# Altium schematic sheet Buck.SchDoc
size A3; SheetNumber: 1; SheetTotal: 1
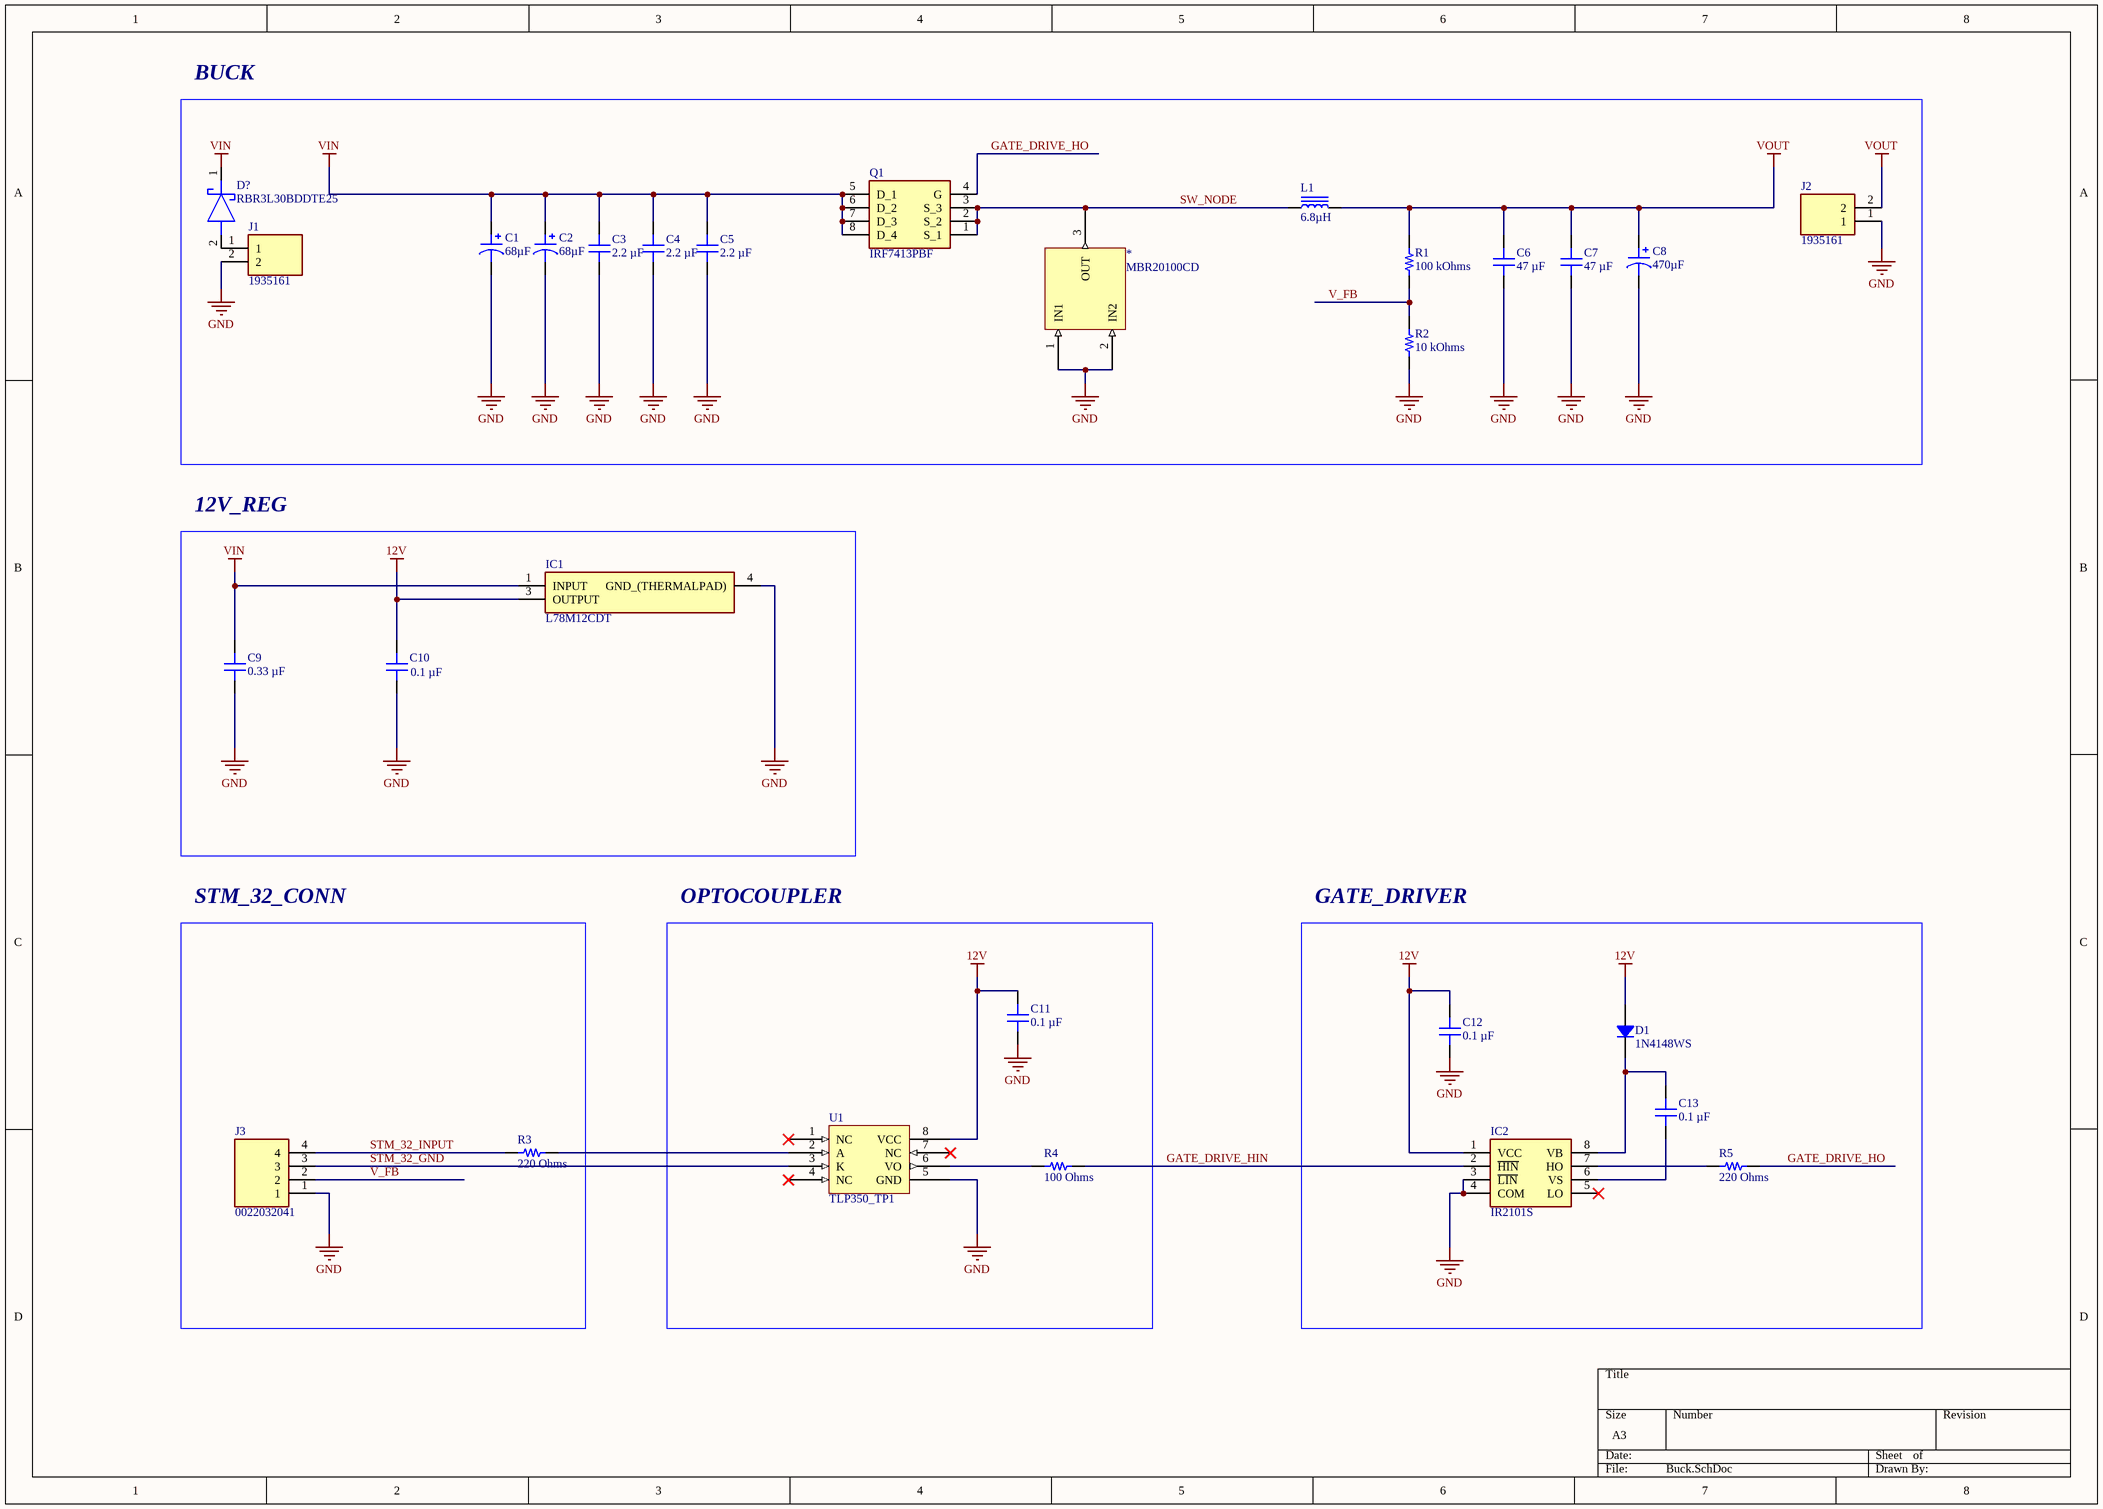
[diagram p0: Buck.SchDoc]

## Parts
*  MBR20100CD  [SC_TO-252AA]
C1  68µF  [CAP ALSMD 6.6MM H6.1MM]
C2  68µF  [CAP ALSMD 6.6MM H6.1MM]
C3  2.2 µF  [CAP 1210_3225 - 1MM]
C4  2.2 µF  [CAP 1210_3225 - 1MM]
C5  2.2 µF  [CAP 1210_3225 - 1MM]
C6  47 µF  [CAP 1210_3225 - 1MM]
C7  47 µF  [CAP 1210_3225 - 1MM]
C8  470µF  [CAP ALSMD 6.6MM H8.0MM]
C9  0.33 µF  [CAP 1210_3225 - 1MM]
C10  0.1 µF  [CAP 1210_3225 - 1MM]
C11  0.1 µF  [CAP 0805_2012]
C12  0.1 µF  [CAP 0805_2012]
C13  0.1 µF  [CAP 0805_2012]
D1  1N4148WS  [SOD323F]
D?  RBR3L30BDDTE25  [DIOM5026X220N]
IC1  L78M12CDT  [TO228P972X240-3N]
IC2  IR2101S  [SOIC127P600X175-8N]
J1  1935161  [1935161]
J2  1935161  [1935161]
J3  0022032041  [HDRV4W87P0X254_1X4_991X236X1155P]
L1  6.8µH  [BOURNS SRR1280]
Q1  IRF7413PBF  [SOIC127P600X175-8N]
R1  100 kOhms  [RES 0805_2012]
R2  10 kOhms  [RES 0805_2012]
R3  220 Ohms  [RES 0805_2012]
R4  100 Ohms  [RES 0805_2012]
R5  220 Ohms  [RES 0805_2012]
U1  TLP350_TP1  [SOP254P1000X425-8N]

## Blocks framed on the sheet
BUCK: * C1-C8 D? J1 J2 L1 Q1 R1 R2
12V_REG: C9 C10 IC1
STM_32_CONN: J3 R3
OPTOCOUPLER: C11 R4 U1
GATE_DRIVER: C12 C13 D1 IC2 R5

## Nets
12V: C10.2 C11.2 C12.2 D1.1 IC1.3(OUTPUT) IC2.1(VCC) U1.8(VCC)
GND: *.1(IN1) *.2(IN2) C1.2 C2.2 C3.1 C4.1 C5.1 C6.1 C7.1 C8.2 C9.1 C10.1 C11.1 C12.1 IC1.4(GND_(THERMALPAD)) IC2.3(~{LIN}) IC2.4(COM) J1.2 J2.1 J3.1 R2.1 U1.5(GND)
VIN: C1.1 C2.1 C3.2 C4.2 C5.2 C9.2 D?.1(K) IC1.1(INPUT) Q1.5(D_1) Q1.6(D_2) Q1.7(D_3) Q1.8(D_4)
VOUT: C6.2 C7.2 C8.1 J2.2 L1.2 R1.2
GATE_DRIVE_HIN: IC2.2(~{HIN}) R4.2
GATE_DRIVE_HO: Q1.4(G) R5.2
STM_32_GND: J3.3 U1.3(K)
STM_32_INPUT: J3.4 R3.1
SW_NODE: *.3(OUT) L1.1 Q1.1(S_1) Q1.2(S_2) Q1.3(S_3)
V_FB: J3.2 R1.1 R2.2
NetC13_1: C13.1 IC2.6(VS)
NetC13_2: C13.2 D1.2 IC2.8(VB)
NetD?_2: D?.2(A) J1.1
NetIC2_7: IC2.7(HO) R5.1
NetR3_2: R3.2 U1.2(A)
NetR4_1: R4.1 U1.6(VO)

Not connected (* = marked no-connect by the designer): IC2 5(LO)*; U1 1(NC)* 4(NC)* 7(NC)*

## Library data of the parts
C1 C2 = UWD1E680MCL1GS: CAP ALUM 68UF 20% 25V SMD; Manufacturer: Nichicon; Impedance: 440 mOhms; Lifetime @ Temp.: 2000 Hrs @ 105°C; Ripple Current @ High Frequency: 230mA @ 100kHz; Ripple Current @ Low Frequency: 115mA @ 120Hz; Surface Mount Land Size: 0.260" L x 0.260" W (6.60mm x 6.60mm); Part Number: UWD1E680MCL1GS; Applications: General Purpose; Capacitance: 68µF; ComponentLink1Description: Datasheet; ComponentLink1URL: http://nichicon-us.com/english/products/pdfs/e-uwd.pdf; ComponentLink2Description: DigiKey Link; ComponentLink2URL: http://digikey.com/product-detail/en/nichicon/UWD1E680MCL1GS/493-9673-1-ND/3963005; Device Package: Radial, Can - SMD; Height - Seated (Max): 0.228" (5.80mm); LastUpdated: 1/21/2020 2:33:32 AM; Lifecycle Status: Active; Minimum Order: 1; Mounting Type: Surface Mount; Operating Temperature: -55°C ~ 105°C; Package / Case: Radial, Can - SMD; Packaging: TapeAndReel; PartId: 8861; Part Status: Active; Price: 0.22; Series: UWD; Size / Dimension: 0.248" Dia (6.30mm); Supplier 1: DigiKey; Supplier Part Number 1: 493-9673-1-ND; Tolerance: ±20%; Value: 68µF; Voltage - Rated: 25V
C3-C5 = TMF325B7225KMHP: CAP CER 2.2UF 25V X7R 1210; manufacturer: Taiyo Yuden; Tolerance: ±10%; Part Number: TMF325B7225KMHP; Value: 2.2 µF; Applications: Automotive, SMPS Filtering; Capacitance: 2.2 µF; componentlink1description: Datasheet; componentlink1url: https://ds.yuden.co.jp/TYCOMPAS/ut/detail?pn=TMF325B7225KMHP&u=M; componentlink2description: DigiKey Link; componentlink2url: https://www.digikey.com/en/products/detail/taiyo-yuden/TMF325B7225KMHP/10379029; Device Package: 1210 (3225 Metric); lastupdated: 9/19/2022 01:23:29 PM; Lifecycle Status: Active; Minimum Order: 1; Mounting Type: Surface Mount, MLCC; Operating Temperature: -55°C ~ 125°C; Package / Case: 1210 (3225 Metric); packaging: TapeAndReel; partid: 23880; Part Status: Active; price: 0.17; Ratings: AEC-Q200; series: M; Size / Dimension: 0.126" L x 0.098" W (3.20mm x 2.50mm); Supplier 1: DigiKey; Supplier Part Number 1: 587-6463-1-ND; Temperature Coefficient: X7R; Thickness (Max): 0.106" (2.70mm); Voltage - Rated: 25V
C6 C7 = GRM32ED71A476KE15L: CAP CER 47UF 10V X7T 1210; Part Number: GRM32ED71A476KE15L; Value: 47 µF
C8 = EMZR100ARA471MF80G: CAP ALUM 470UF 20% 10V SMD; Manufacturer: United Chemi-Con; ESR (Equivalent Series Resistance): 160 mohm @ 100kHz; Lifetime @ Temp.: 2000 Hrs @ 105°C; Polarization: Polar; Ripple Current @ High Frequency: 600mA @ 100kHz; Ripple Current @ Low Frequency: 300mA @ 120Hz; Surface Mount Land Size: 0.260" L x 0.260" W (6.60mm x 6.60mm); Part Number: EMZR100ARA471MF80G; Applications: Automotive; Capacitance: 470µF; ComponentLink1Description: Datasheet; ComponentLink1URL: http://www.chemi-con.co.jp/cgi-bin/CAT_DB/SEARCH/cat_db_al.cgi?e=e&j=p&pdfname=mzr; ComponentLink2Description: DigiKey Link; ComponentLink2URL: http://digikey.com/product-detail/en/united-chemi-con/EMZR100ARA471MF80G/565-5133-1-ND/8637128; Device Package: Radial, Can - SMD; Height - Seated (Max): 0.315" (8.00mm); LastUpdated: 1/21/2020 4:06:45 AM; Lifecycle Status: Active; Minimum Order: 1; Mounting Type: Surface Mount; Operating Temperature: -55°C ~ 105°C; Package / Case: Radial, Can - SMD; Packaging: TapeAndReel; PartId: 8433; Part Status: Active; Price: 0.20; Ratings: AEC-Q200; Series: Alchip™- MZR; Size / Dimension: 0.248" Dia (6.30mm); Supplier 1: DigiKey; Supplier Part Number 1: 565-5133-1-ND; Tolerance: ±20%; Value: 470µF; Voltage - Rated: 10V
C9 = 885012209044: CAP CER 0.33UF 50V X7R 1210; manufacturer: Würth Elektronik; Tolerance: ±10%; Part Number: 885012209044; Value: 0.33 µF; Applications: General Purpose; Capacitance: 0.33 µF; componentlink1description: Datasheet; componentlink1url: https://katalog.we-online.de/pbs/datasheet/885012209044.pdf; componentlink2description: DigiKey Link; componentlink2url: https://www.digikey.com/en/products/detail/würth-elektronik/885012209044/5453596; Device Package: 1210 (3225 Metric); lastupdated: 9/19/2022 01:23:29 PM; Lifecycle Status: Active; Minimum Order: 1; Mounting Type: Surface Mount, MLCC; Operating Temperature: -55°C ~ 125°C; Package / Case: 1210 (3225 Metric); packaging: TapeAndReel; partid: 25056; Part Status: Active; price: 0.36; series: WCAP-CSGP; Size / Dimension: 0.126" L x 0.098" W (3.20mm x 2.50mm); Supplier 1: DigiKey; Supplier Part Number 1: 732-7741-1-ND; Temperature Coefficient: X7R; Thickness (Max): 0.053" (1.35mm); Voltage - Rated: 50V
C10 = UMF325B7104KNHT: CAP CER 0.1UF 50V X7R 1210; manufacturer: Taiyo Yuden; Tolerance: ±10%; Part Number: UMF325B7104KNHT; Value: 0.1 µF; Applications: Automotive, SMPS Filtering; Capacitance: 0.1 µF; componentlink1description: Datasheet; componentlink1url: https://ds.yuden.co.jp/TYCOMPAS/ut/detail?pn=UMF325B7104KNHT&u=M; componentlink2description: DigiKey Link; componentlink2url: https://www.digikey.com/en/products/detail/taiyo-yuden/UMF325B7104KNHT/10379043; Device Package: 1210 (3225 Metric); lastupdated: 9/19/2022 01:23:27 PM; Lifecycle Status: Active; Minimum Order: 1; Mounting Type: Surface Mount, MLCC; Operating Temperature: -55°C ~ 125°C; Package / Case: 1210 (3225 Metric); packaging: TapeAndReel; partid: 24590; Part Status: Active; price: 0.12; Ratings: AEC-Q200; series: M; Size / Dimension: 0.126" L x 0.098" W (3.20mm x 2.50mm); Supplier 1: DigiKey; Supplier Part Number 1: 587-6477-1-ND; Temperature Coefficient: X7R; Thickness (Max): 0.083" (2.10mm); Voltage - Rated: 50V
C11-C13 = CC0805MRX7R9BB104: CAP CER 0.1UF 50V X7R 0805; manufacturer: Yageo; Tolerance: ±20%; Part Number: CC0805MRX7R9BB104; Value: 0.1 µF; Applications: General Purpose; Capacitance: 0.1 µF; componentlink1description: Datasheet; componentlink1url: https://www.yageo.com/upload/media/product/productsearch/datasheet/mlcc/UPY-GPHC_X7R_6.3V-to-50V_18.pdf; componentlink2description: DigiKey Link; componentlink2url: https://www.digikey.com/en/products/detail/yageo/CC0805MRX7R9BB104/5884281; Device Package: 0805 (2012 Metric); lastupdated: 9/19/2022 01:04:26 PM; Lifecycle Status: Active; Minimum Order: 1; Mounting Type: Surface Mount, MLCC; Operating Temperature: -55°C ~ 125°C; Package / Case: 0805 (2012 Metric); packaging: TapeAndReel; partid: 2475; Part Status: Active; price: 0.02; series: CC; Size / Dimension: 0.079" L x 0.049" W (2.00mm x 1.25mm); Supplier 1: DigiKey; Supplier Part Number 1: 311-4351-1-ND; Temperature Coefficient: X7R; Thickness (Max): 0.037" (0.95mm); Voltage - Rated: 50V
D1 = 1N4148WS: DIODE GEN PURP 75V 150MA SOD323F; Part Number: 1N4148WS
D? = RBR3L30BDDTE25: Schottky Diode; Manufacturer_Name: ROHM Semiconductor; Datasheet Link: https://fscdn.rohm.com/en/products/databook/datasheet/discrete/diode/schottky_barrier/rbr3l30bddte25-e.pdf; Height: 2.2mm; Manufacturer_Part_Number: RBR3L30BDDTE25; Mouser Part Number: 755-RBR3L30BDDTE25; Mouser Price/Stock: https://www.mouser.co.uk/ProductDetail/ROHM-Semiconductor/RBR3L30BDDTE25?qs=4v%252BiZTmLVHEWHyOjRRmz3Q%3D%3D
IC1 = L78M12CDT: Integrated Circuit; Manufacturer_Name: STMicroelectronics; Datasheet Link: http://www.st.com/st-web-ui/static/active/en/resource/technical/document/datasheet/CD00000447.pdf; Height: 2.4mm; Manufacturer_Part_Number: L78M12CDT; Mouser Part Number: 511-L78M12CDT; Mouser Price/Stock: https://www.mouser.co.uk/ProductDetail/STMicroelectronics/L78M12CDT?qs=hUhhBvpTJN9yD9OLpyEzTA%3D%3D
IC2 = IR2101S: Integrated Circuit; Manufacturer_Name: Infineon; Datasheet Link: https://pdf1.alldatasheet.com/datasheet-pdf/view/102221/IRF/IR2101S.html; Height: 1.75mm; Manufacturer_Part_Number: IR2101S
J1 J2 = 1935161: Connector; Manufacturer_Name: Phoenix Contact; Datasheet Link: https://datasheet.datasheetarchive.com/originals/distributors/SFDatasheet-2/sf-00057459.pdf; Height: 11.55mm; Manufacturer_Part_Number: 1935161; Mouser Part Number: 651-1935161; Mouser Price/Stock: https://www.mouser.co.uk/ProductDetail/Phoenix-Contact/1935161?qs=W3wJikR1%252BS6eKzfFl8Rbew%3D%3D; Arrow Part Number: 1935161; Arrow Price/Stock: https://www.arrow.com/en/products/1935161/phoenix-contact?region=nac
J3 = 0022032041: Connector; Manufacturer_Name: Molex; Datasheet Link: http://www.molex.com/pdm_docs/sd/022032041_sd.pdf; Height: 11.55mm; Manufacturer_Part_Number: 0022032041; Mouser Part Number: N/A; Mouser Price/Stock: https://www.mouser.co.uk/ProductDetail/Molex/0022032041?qs=PBcRNPEHKsrt5pJfEqGMHQ%3D%3D; Arrow Part Number: 0022032041; Arrow Price/Stock: https://www.arrow.com/en/products/0022032041/molex
L1 = SRR1280-6R8Y: FIXED IND 6.8UH 7.6A 18.5MOHM SM; Manufacturer: Bourns Inc.; Current - Saturation: 8A; DC Resistance (DCR): 18.5mOhm Max; Frequency - Self Resonant: 22MHz; Inductance Frequency - Test: 100kHz; Material - Core: Ferrite; Q @ Freq: 20 @ 7.96MHz; Shielding: Shielded; Tolerance: ±30%; Type: Wirewound; Part Number: SRR1280-6R8Y; ComponentLink1Description: Datasheet; ComponentLink1URL: https://www.bourns.com/docs/Product-Datasheets/SRR1280.pdf; ComponentLink2Description: DigiKey Link; ComponentLink2URL: http://digikey.com/product-detail/en/bourns-inc/SRR1280-6R8Y/SRR1280-6R8YCT-ND/3986771; Current Rating (Amps): 7.6A; Device Package: Nonstandard; Height - Seated (Max): 0.315" (8.00mm); Inductance: 6.8µH; LastUpdated: 1/21/2020 3:25:29 AM; Lifecycle Status: Active; Minimum Order: 1; Mounting Type: Surface Mount; Operating Temperature: -40°C ~ 125°C; Package / Case: Nonstandard; Packaging: TapeAndReel; PartId: 41; Part Status: Active; Price: 0.65; Series: SRR1280; Size / Dimension: 0.492" L x 0.492" W (12.50mm x 12.50mm); Supplier 1: DigiKey; Supplier Part Number 1: SRR1280-6R8YCT-ND; Value: 6.8µH
Q1 = IRF7413PBF: MOSFET (N-Channel); Manufacturer_Name: Infineon; Datasheet Link: https://www.infineon.com/dgdl/Infineon-IRF7413-DataSheet-v01_01-EN.pdf?fileId=5546d462533600a4015355fa8e901bb8; Height: 1.75mm; Manufacturer_Part_Number: IRF7413PBF; Mouser Part Number: 942-IRF7413PBF; Mouser Price/Stock: https://www.mouser.co.uk/ProductDetail/Infineon-IR/IRF7413PBF?qs=am%252BH1kEnjyaqXaR%2F2xDamA%3D%3D; Arrow Part Number: IRF7413PBF; Arrow Price/Stock: https://www.arrow.com/en/products/irf7413pbf/infineon-technologies-ag
R1 = CPF0805B100KE: RES SMD 100K OHM 0.1% 1/10W 0805; Manufacturer: TE Connectivity Passive Product; Power (Watts): 0.1W, 1/10W; Temperature Coefficient: ±25ppm/°C; Part Number: CPF0805B100KE; Value: 100 kOhms; ComponentLink1Description: Datasheet; ComponentLink1URL: https://www.te.com/commerce/DocumentDelivery/DDEController?Action=srchrtrv&DocNm=1773200&DocType=DS&DocLang=English; ComponentLink2Description: DigiKey Link; ComponentLink2URL: https://www.digikey.com/en/products/detail/te-connectivity-passive-product/CPF0805B100KE/2389788; Composition: Thin Film; Device Package: 0805 (2012 Metric); Height - Seated (Max): 0.026" (0.65mm); LastUpdated: 9/19/2022 01:36:59 PM; Lifecycle Status: Active; Minimum Order: 1; Number of Terminations: 2; Operating Temperature: -55°C ~ 155°C; Package / Case: 0805 (2012 Metric); Packaging: TapeAndReel; PartId: 27729; Part Status: Active; Price: 0.10; Resistance: 100 kOhms; Series: CPF, Neohm; Size / Dimension: 0.079" L x 0.049" W (2.00mm x 1.25mm); Supplier 1: DigiKey; Supplier Part Number 1: A106042CT-ND; Supplier Device Package: 0805; Tolerance: ±0.1%
R2 = RNCS0805BKE10K0: RES 10K OHM 0.1% 1/10W 0805; Manufacturer: Stackpole Electronics Inc; Power (Watts): 0.1W, 1/10W; Temperature Coefficient: ±25ppm/°C; Part Number: RNCS0805BKE10K0; Value: 10 kOhms; ComponentLink1Description: Datasheet; ComponentLink1URL: https://www.seielect.com/catalog/sei-rncs_rnch.pdf; ComponentLink2Description: DigiKey Link; ComponentLink2URL: https://www.digikey.com/en/products/detail/stackpole-electronics-inc/RNCS0805BKE10K0/1800067; Composition: Thin Film; Device Package: 0805 (2012 Metric); Features: Anti-Corrosive, Automotive AEC-Q200, Moisture Resistant; Height - Seated (Max): 0.026" (0.65mm); LastUpdated: 9/19/2022 01:36:59 PM; Lifecycle Status: Active; Minimum Order: 1; Number of Terminations: 2; Operating Temperature: -55°C ~ 155°C; Package / Case: 0805 (2012 Metric); Packaging: TapeAndReel; PartId: 27713; Part Status: Active; Price: 0.09; Ratings: AEC-Q200; Resistance: 10 kOhms; Series: RNCS; Size / Dimension: 0.079" L x 0.049" W (2.00mm x 1.25mm); Supplier 1: DigiKey; Supplier Part Number 1: RNCS0805BKE10K0CT-ND; Supplier Device Package: 0805; Tolerance: ±0.1%
R3 R5 = ESR10EZPF2200: RES SMD 220 OHM 1% 0.4W 0805; Manufacturer: Rohm Semiconductor; Power (Watts): 0.4W, 2/5W; Temperature Coefficient: ±100ppm/°C; Part Number: ESR10EZPF2200; Value: 220 Ohms; ComponentLink1Description: Datasheet; ComponentLink1URL: https://www.rohm.com/datasheet/ESR01MZPF/esr-e; ComponentLink2Description: DigiKey Link; ComponentLink2URL: https://www.digikey.com/en/products/detail/rohm-semiconductor/ESR10EZPF2200/1983511; Composition: Thick Film; Device Package: 0805 (2012 Metric); Features: Automotive AEC-Q200, Pulse Withstanding; Height - Seated (Max): 0.026" (0.65mm); LastUpdated: 9/19/2022 01:36:58 PM; Lifecycle Status: Active; Minimum Order: 1; Number of Terminations: 2; Operating Temperature: -55°C ~ 155°C; Package / Case: 0805 (2012 Metric); Packaging: TapeAndReel; PartId: 28037; Part Status: Active; Price: 0.02; Ratings: AEC-Q200; Resistance: 220 Ohms; Series: ESR; Size / Dimension: 0.079" L x 0.049" W (2.00mm x 1.25mm); Supplier 1: DigiKey; Supplier Part Number 1: RHM220AECT-ND; Supplier Device Package: 0805; Tolerance: ±1%
R4 = RCS0805100RFKEA: RES SMD 100 OHM 1% 1/2W 0805; Manufacturer: Vishay Dale; Power (Watts): 0.5W, 1/2W; Temperature Coefficient: ±100ppm/°C; Part Number: RCS0805100RFKEA; Value: 100 Ohms; ComponentLink1Description: Datasheet; ComponentLink1URL: http://www.vishay.com/docs/20065/rcse3.pdf; ComponentLink2Description: DigiKey Link; ComponentLink2URL: https://www.digikey.com/en/products/detail/vishay-dale/RCS0805100RFKEA/5866980; Composition: Thick Film; Device Package: 0805 (2012 Metric); Features: Automotive AEC-Q200, Pulse Withstanding; Height - Seated (Max): 0.020" (0.50mm); LastUpdated: 9/19/2022 01:36:59 PM; Lifecycle Status: Active; Minimum Order: 1; Number of Terminations: 2; Operating Temperature: -55°C ~ 155°C; Package / Case: 0805 (2012 Metric); Packaging: TapeAndReel; PartId: 27784; Part Status: Active; Price: 0.02; Ratings: AEC-Q200; Resistance: 100 Ohms; Series: RCS e3; Size / Dimension: 0.079" L x 0.049" W (2.00mm x 1.25mm); Supplier 1: DigiKey; Supplier Part Number 1: 541-2834-1-ND; Supplier Device Package: 0805; Tolerance: ±1%